# Altium schematic sheet E157 DP1.SchDoc
size A; SheetNumber: 1; SheetTotal: 1
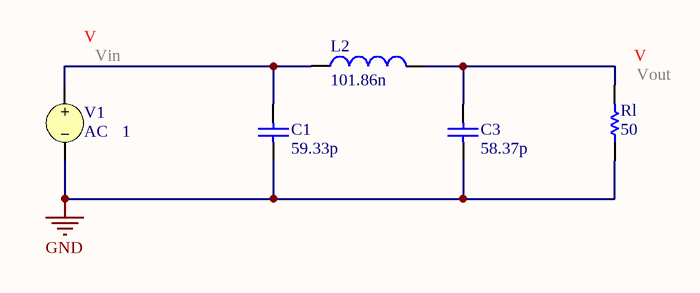
[diagram p0: E157 DP1.SchDoc]

## Parts
C1  value 59.33p  (hidden comment: Capacitor)
C3  value 58.37p  (hidden comment: Capacitor)
L2  value 101.86n  (hidden comment: Inductor)
Rl  value 50  (hidden comment: Resistor)
V1  AC Magnitude: 1  (hidden comment: DC)

## Nets
GND: C1.1 C3.1 Rl.1 V1.2
NetC1_2: C1.2 L2.1 V1.1
NetC3_2: C3.2 L2.2 Rl.2

## Notes on the sheet
- (near V1) AC

## Library data of the parts
C1 C3 = Capacitor: SimulationGenericComponent: True
L2 = Inductor: SimulationGenericComponent: True
Rl = Resistor: TC1: 0; SimulationGenericComponent: True; TC2: 0
V1 = VSRC: Voltage Source; Note: PCB Footprint - Not required; AC Phase: Rser=50; Published: 8-Jun-2000; LatestRevisionDate: 17-Jul-2002; LatestRevisionNote: Re-released for DXP Platform.; PackageReference: Not Applicable; Publisher: Altium Limited